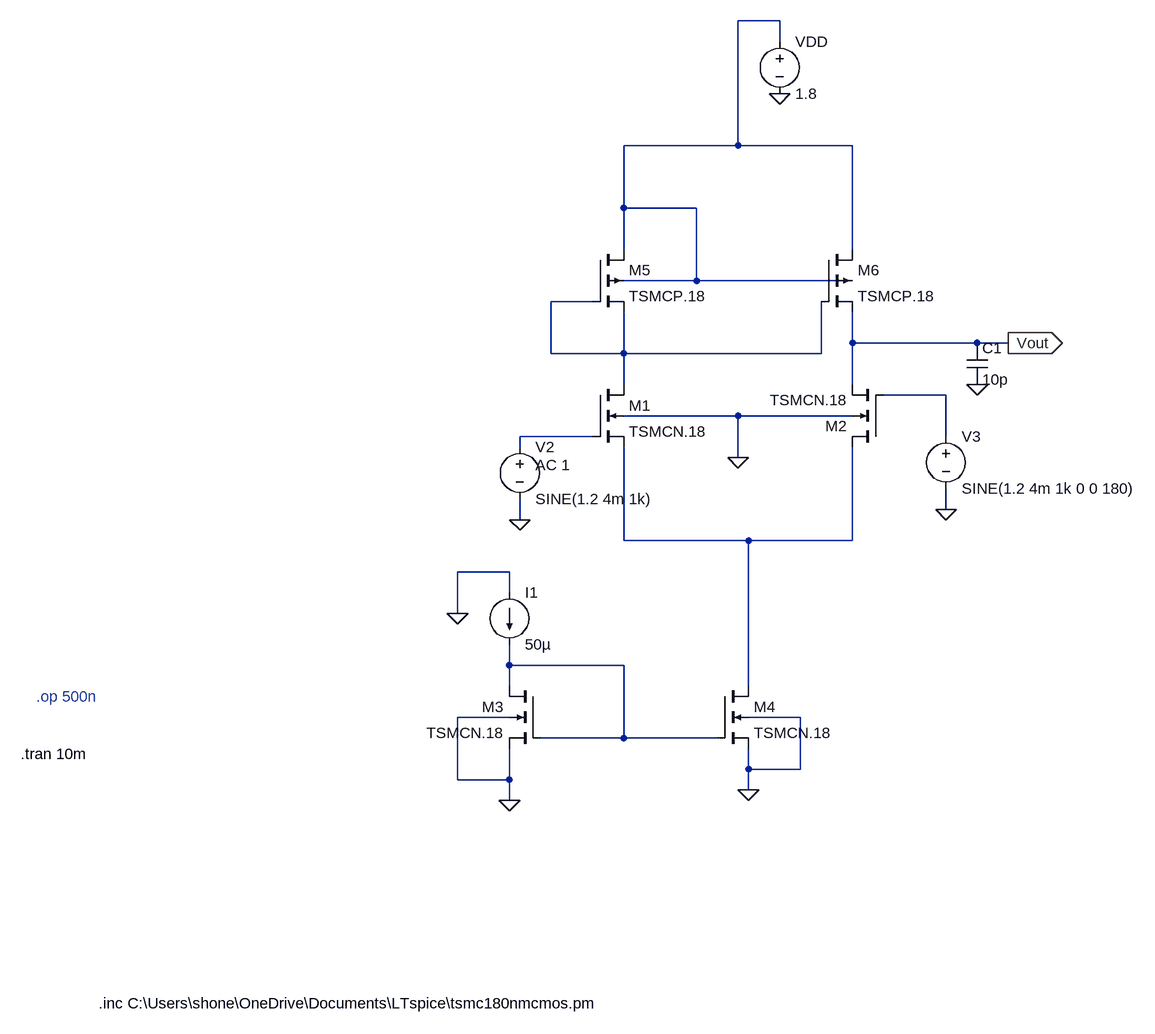
[diagram p0: schematic differential amplifier tsmc180nm.asc]
differential amplifier tsmc180nm.asc, the LTspice schematic file:
Version 4.1
SHEET 1 2176 696
WIRE 1168 -832 1104 -832
WIRE 1168 -800 1168 -832
WIRE 1104 -640 1104 -832
WIRE 1104 -640 928 -640
WIRE 1280 -640 1104 -640
WIRE 928 -544 928 -640
WIRE 1040 -544 928 -544
WIRE 928 -480 928 -544
WIRE 1280 -480 1280 -640
WIRE 1040 -432 1040 -544
WIRE 1040 -432 928 -432
WIRE 1280 -432 1040 -432
WIRE 880 -400 816 -400
WIRE 1280 -336 1280 -384
WIRE 1472 -336 1280 -336
WIRE 1520 -336 1472 -336
WIRE 816 -320 816 -400
WIRE 928 -320 928 -384
WIRE 928 -320 816 -320
WIRE 1232 -320 1232 -400
WIRE 1232 -320 928 -320
WIRE 928 -272 928 -320
WIRE 1280 -272 1280 -336
WIRE 1424 -256 1328 -256
WIRE 1104 -224 928 -224
WIRE 1280 -224 1104 -224
WIRE 880 -192 768 -192
WIRE 1424 -192 1424 -256
WIRE 768 -176 768 -192
WIRE 1104 -160 1104 -224
WIRE 1424 -80 1424 -112
WIRE 768 -64 768 -96
WIRE 928 -32 928 -176
WIRE 1120 -32 928 -32
WIRE 1280 -32 1280 -176
WIRE 1280 -32 1120 -32
WIRE 752 16 672 16
WIRE 752 48 752 16
WIRE 672 80 672 16
WIRE 752 160 752 128
WIRE 928 160 752 160
WIRE 752 192 752 160
WIRE 1120 192 1120 -32
WIRE 752 240 672 240
WIRE 1200 240 1120 240
WIRE 928 272 928 160
WIRE 928 272 800 272
WIRE 1072 272 928 272
WIRE 1120 320 1120 288
WIRE 1200 320 1200 240
WIRE 1200 320 1120 320
WIRE 672 336 672 240
WIRE 752 336 752 288
WIRE 752 336 672 336
WIRE 1120 352 1120 320
WIRE 752 368 752 336
FLAG 752 368 0
FLAG 1120 352 0
FLAG 672 80 0
FLAG 768 -64 0
FLAG 1424 -80 0
FLAG 1104 -160 0
FLAG 1168 -720 0
FLAG 1520 -336 Vout
IOPIN 1520 -336 Out
FLAG 1472 -272 0
SYMBOL nmos4 880 -272 R0
SYMATTR InstName M1
SYMATTR Value TSMCN.18
SYMATTR Value2 l=1u w=9u
SYMBOL nmos4 1328 -176 R180
SYMATTR InstName M2
SYMATTR Value TSMCN.18
SYMATTR Value2 l=1u w=9u
SYMBOL nmos4 800 192 M0
SYMATTR InstName M3
SYMATTR Value TSMCN.18
SYMATTR Value2 l=1u w=6u
SYMBOL nmos4 1072 192 R0
SYMATTR InstName M4
SYMATTR Value TSMCN.18
SYMATTR Value2 l=1u w=6u
SYMBOL pmos4 880 -480 R0
SYMATTR InstName M5
SYMATTR Value TSMCP.18
SYMATTR Value2 l=1u w=48u
SYMBOL pmos4 1232 -480 R0
SYMATTR InstName M6
SYMATTR Value TSMCP.18
SYMATTR Value2 l=1u w=48u
SYMBOL voltage 1168 -816 R0
SYMATTR InstName VDD
SYMATTR Value 1.8
SYMBOL voltage 768 -192 R0
WINDOW 123 24 44 Left 2
WINDOW 39 0 0 Left 0
SYMATTR InstName V2
SYMATTR Value SINE(1.2 4m 1k)
SYMATTR Value2 AC 1
SYMBOL voltage 1424 -208 R0
WINDOW 123 0 0 Left 0
WINDOW 39 0 0 Left 0
SYMATTR InstName V3
SYMATTR Value SINE(1.2 4m 1k 0 0 180)
SYMBOL current 752 48 R0
WINDOW 123 0 0 Left 0
WINDOW 39 0 0 Left 0
SYMATTR InstName I1
SYMATTR Value 50µ
SYMBOL cap 1456 -336 R0
SYMATTR InstName C1
SYMATTR Value 10p
TEXT 120 680 Left 2 !.inc C:\\Users\\shone\\OneDrive\\Documents\\LTspice\\tsmc180nmcmos.pm
TEXT 0 296 Left 2 !.tran 10m
TEXT 24 208 Left 2 ;.op 500n

The netlist it stands for:
* differential amplifier tsmc180nm.asc
M1 N002 N004 N005 0 TSMCN.18 l=1u w=9u
M2 N005 N003 Vout 0 TSMCN.18 l=1u w=9u
M3 N006 N006 0 0 TSMCN.18 l=1u w=6u
M4 N005 N006 0 0 TSMCN.18 l=1u w=6u
M5 N001 N002 N002 N001 TSMCP.18 l=1u w=48u
M6 N001 N002 Vout N001 TSMCP.18 l=1u w=48u
VDD N001 0 1.8
V2 N004 0 SINE(1.2 4m 1k) AC 1
V3 N003 0 SINE(1.2 4m 1k 0 0 180)
I1 0 N006 50µ
C1 Vout 0 10p
.model NMOS NMOS
.model PMOS PMOS
.lib standard.mos
.inc C:\Users\shone\OneDrive\Documents\LTspice\tsmc180nmcmos.pm
.tran 10m
* .op 500n
.backanno
.end